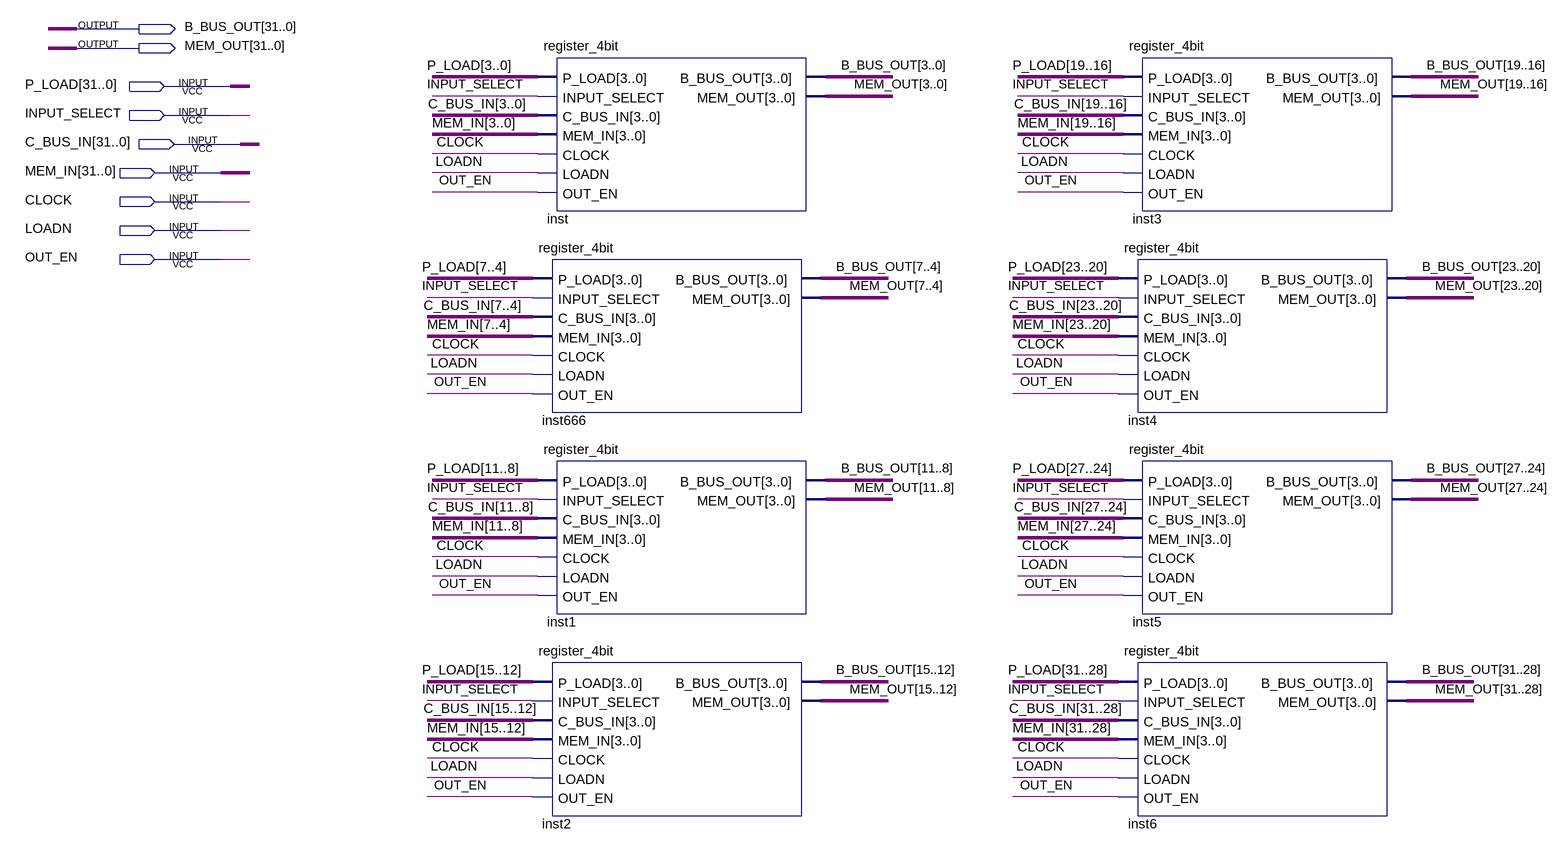
[diagram p0: schematic sheet]
// Quartus schematic register_32bit.bdf as structural Verilog: 8 symbols, 9 pins
module register_32bit (
  input  [31:0] P_LOAD,
  input  INPUT_SELECT,
  input  [31:0] C_BUS_IN,
  input  [31:0] MEM_IN,
  input  CLOCK,
  input  LOADN,
  input  OUT_EN,
  output [31:0] B_BUS_OUT,
  output [31:0] MEM_OUT
);

  register_4bit inst (
    .P_LOAD(P_LOAD[3:0]), .INPUT_SELECT(INPUT_SELECT), .C_BUS_IN(C_BUS_IN[3:0]), .MEM_IN(MEM_IN[3:0]),
    .CLOCK(CLOCK), .LOADN(LOADN), .OUT_EN(OUT_EN), .B_BUS_OUT(B_BUS_OUT[3:0]), .MEM_OUT(MEM_OUT[3:0]));
  register_4bit inst666 (
    .P_LOAD(P_LOAD[7:4]), .INPUT_SELECT(INPUT_SELECT), .C_BUS_IN(C_BUS_IN[7:4]), .MEM_IN(MEM_IN[7:4]),
    .CLOCK(CLOCK), .LOADN(LOADN), .OUT_EN(OUT_EN), .B_BUS_OUT(B_BUS_OUT[7:4]), .MEM_OUT(MEM_OUT[7:4]));
  register_4bit inst1 (
    .P_LOAD(P_LOAD[11:8]), .INPUT_SELECT(INPUT_SELECT), .C_BUS_IN(C_BUS_IN[11:8]), .MEM_IN(MEM_IN[11:8]),
    .CLOCK(CLOCK), .LOADN(LOADN), .OUT_EN(OUT_EN), .B_BUS_OUT(B_BUS_OUT[11:8]), .MEM_OUT(MEM_OUT[11:8]));
  register_4bit inst2 (
    .P_LOAD(P_LOAD[15:12]), .INPUT_SELECT(INPUT_SELECT), .C_BUS_IN(C_BUS_IN[15:12]), .MEM_IN(MEM_IN[15:12]),
    .CLOCK(CLOCK), .LOADN(LOADN), .OUT_EN(OUT_EN), .B_BUS_OUT(B_BUS_OUT[15:12]), .MEM_OUT(MEM_OUT[15:12]));
  register_4bit inst3 (
    .P_LOAD(P_LOAD[19:16]), .INPUT_SELECT(INPUT_SELECT), .C_BUS_IN(C_BUS_IN[19:16]), .MEM_IN(MEM_IN[19:16]),
    .CLOCK(CLOCK), .LOADN(LOADN), .OUT_EN(OUT_EN), .B_BUS_OUT(B_BUS_OUT[19:16]), .MEM_OUT(MEM_OUT[19:16]));
  register_4bit inst4 (
    .P_LOAD(P_LOAD[23:20]), .INPUT_SELECT(INPUT_SELECT), .C_BUS_IN(C_BUS_IN[23:20]), .MEM_IN(MEM_IN[23:20]),
    .CLOCK(CLOCK), .LOADN(LOADN), .OUT_EN(OUT_EN), .B_BUS_OUT(B_BUS_OUT[23:20]), .MEM_OUT(MEM_OUT[23:20]));
  register_4bit inst5 (
    .P_LOAD(P_LOAD[27:24]), .INPUT_SELECT(INPUT_SELECT), .C_BUS_IN(C_BUS_IN[27:24]), .MEM_IN(MEM_IN[27:24]),
    .CLOCK(CLOCK), .LOADN(LOADN), .OUT_EN(OUT_EN), .B_BUS_OUT(B_BUS_OUT[27:24]), .MEM_OUT(MEM_OUT[27:24]));
  register_4bit inst6 (
    .P_LOAD(P_LOAD[31:28]), .INPUT_SELECT(INPUT_SELECT), .C_BUS_IN(C_BUS_IN[31:28]), .MEM_IN(MEM_IN[31:28]),
    .CLOCK(CLOCK), .LOADN(LOADN), .OUT_EN(OUT_EN), .B_BUS_OUT(B_BUS_OUT[31:28]), .MEM_OUT(MEM_OUT[31:28]));
endmodule
